# EAGLE design MJ808 clone - rev.5 - TCAN334 - poc (EAGLE 9.6.2)
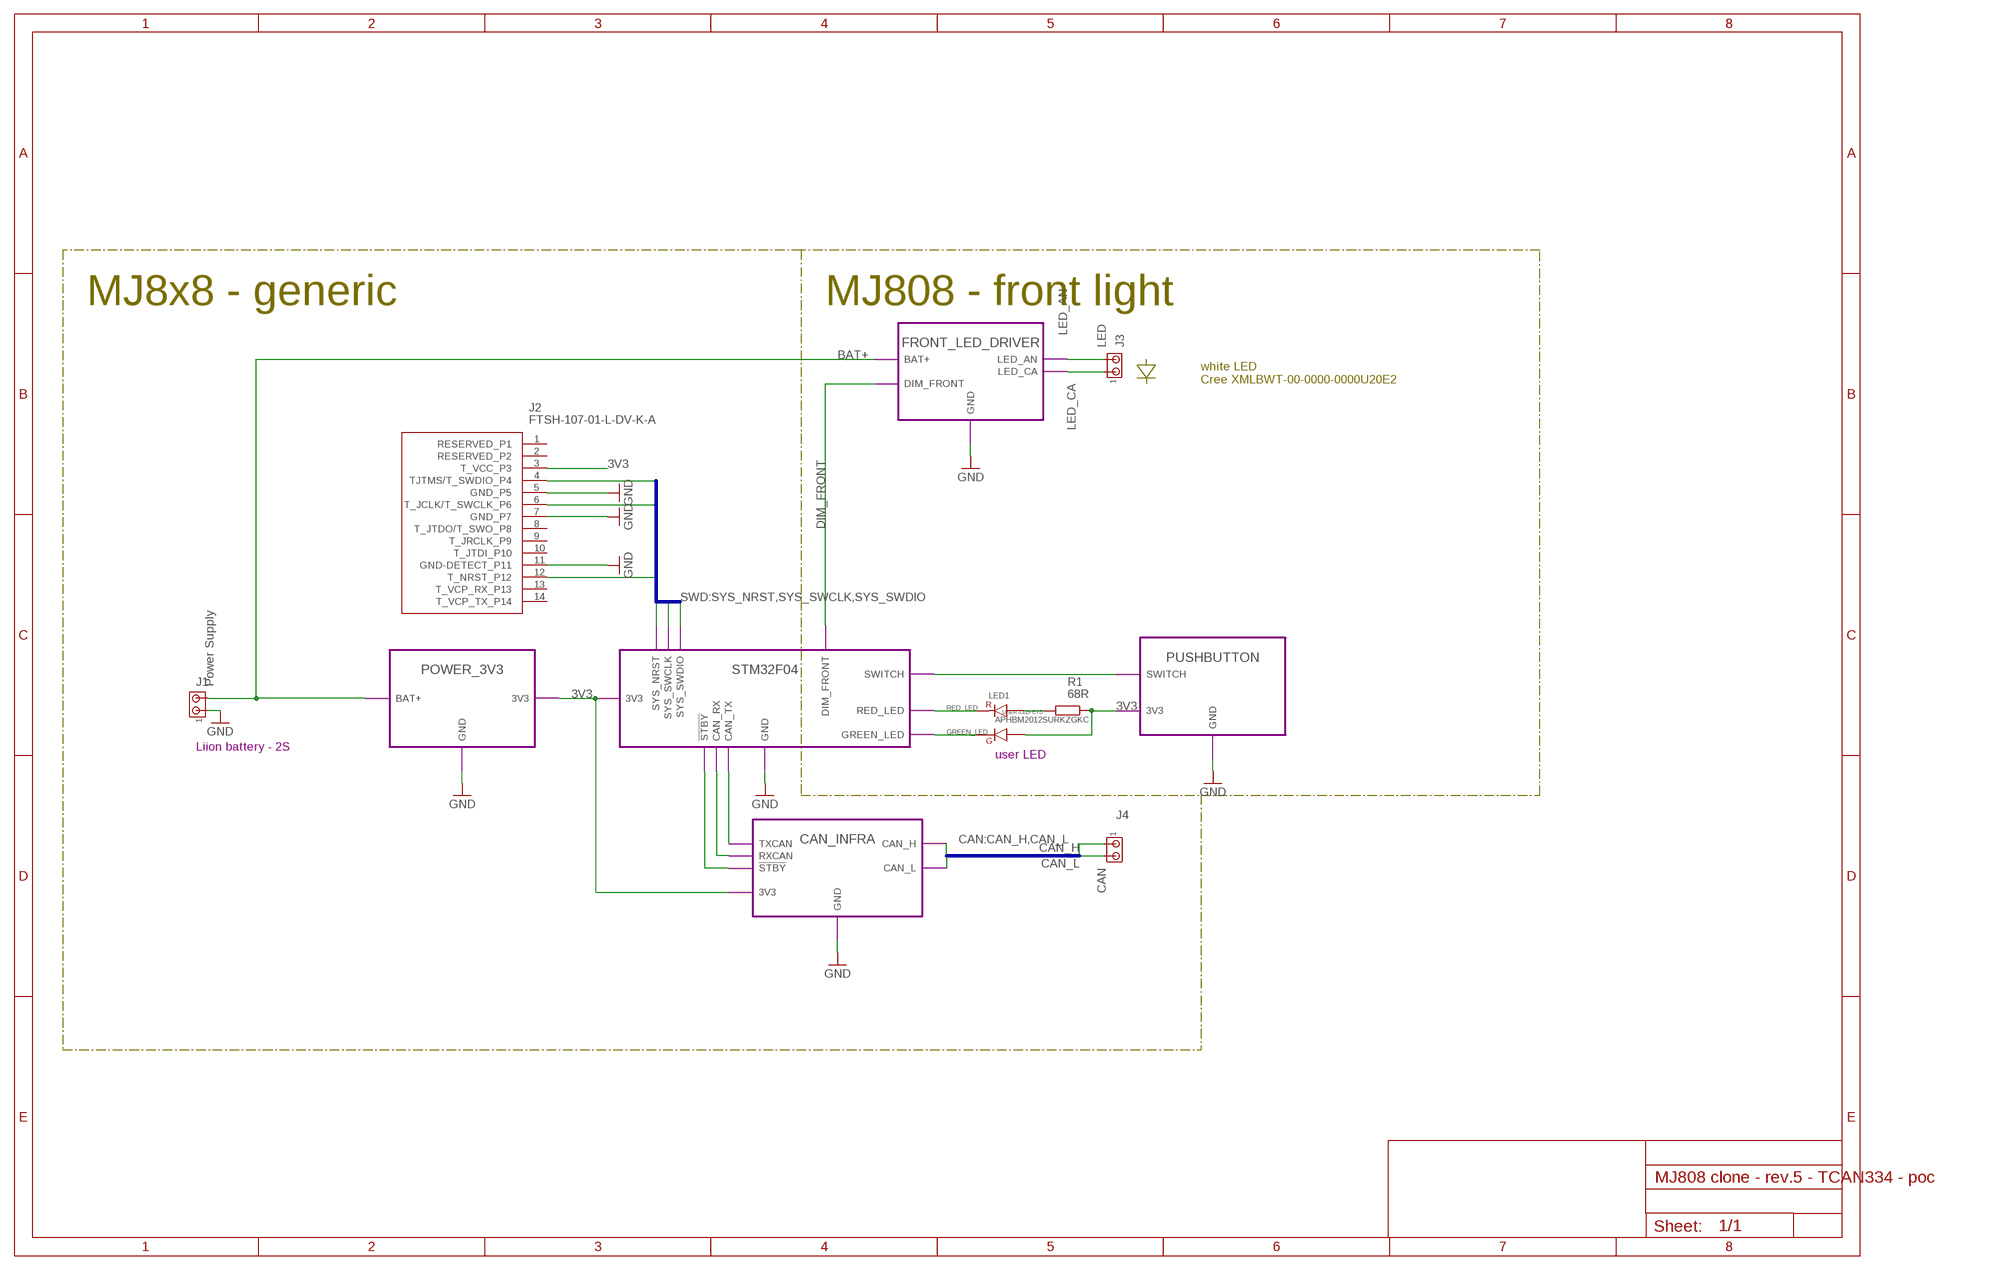
[diagram p0: schematic, sheet 1]

## Parts
J1  Power Supply  MTA02-100  [10X02MTA]
J2  FTSH-107-01-L-DV-K-A  [FTSH10701LDVKA]
J3  LED  MTA02-100  [10X02MTA]
J4  CAN  MTA02-100  [10X02MTA]
LED1  APHBM2012SURKZGKC  APHBM2012LSURKZGKC  [SMD]
R1  68R  R-EU_R0402  [R0402]

## Module instances
POWER_3V3 = POWER_3V3 (part numbers offset by 200)
STM32F04 = STM32 (part numbers offset by 300)
CAN_INFRA = CAN_INFRA (part numbers offset by 400)
FRONT_LED_DRIVER = LED_DRIVER_FRONT (part numbers offset by 500)
PUSHBUTTON = PUSHBUTTON (part numbers offset by 600)

## Nets
3V3 [3V3]: J2.3(T_VCC_P3) LED1.4 R1.1 ; port POWER_3V3.3V3 STM32F04.3V3 CAN_INFRA.3V3 PUSHBUTTON.3V3
!STBY! [signal]: port CAN_INFRA.!STBY! STM32F04.!STBY!
BAT+ [BAT+]: J1.2 ; port POWER_3V3.BAT+ FRONT_LED_DRIVER.BAT+
CAN_H [signal]: J4.1 ; port CAN_INFRA.CAN_H
CAN_L [signal]: J4.2 ; port CAN_INFRA.CAN_L
CAN_RX [signal]: port CAN_INFRA.RXCAN STM32F04.CAN_RX
CAN_TX [signal]: port CAN_INFRA.TXCAN STM32F04.CAN_TX
DIM_FRONT [signal]: port STM32F04.DIM_FRONT FRONT_LED_DRIVER.DIM_FRONT
GND: J1.1 J2.5(GND_P5) J2.7(GND_P7) J2.11(GND-DETECT_P11) ; port STM32F04.GND POWER_3V3.GND CAN_INFRA.GND FRONT_LED_DRIVER.GND PUSHBUTTON.GND
GREEN_LED [signal]: LED1.3 ; port STM32F04.GREEN_LED
LED_AN [BAT+]: J3.2 ; port FRONT_LED_DRIVER.LED_AN
LED_CA [BAT+]: J3.1 ; port FRONT_LED_DRIVER.LED_CA
RED_LED [signal]: LED1.2 ; port STM32F04.RED_LED
SWITCH: port STM32F04.SWITCH PUSHBUTTON.SWITCH
SYS_NRST [signal]: J2.12(T_NRST_P12) ; port STM32F04.SYS_NRST
SYS_SWCLK [signal]: J2.6(T_JCLK/T_SWCLK_P6) ; port STM32F04.SYS_SWCLK
SYS_SWDIO [signal]: J2.4(TJTMS/T_SWDIO_P4) ; port STM32F04.SYS_SWDIO
USER-LED-CTD [signal]: LED1.1 R1.2
Unconnected: J2.1(RESERVED_P1) J2.2(RESERVED_P2) J2.8(T_JTDO/T_SWO_P8) J2.9(T_JRCLK_P9) J2.10(T_JTDI_P10) J2.13(T_VCP_RX_P13) J2.14(T_VCP_TX_P14)

## Buses
CAN:CAN_H,CAN_L
SWD:SYS_NRST,SYS_SWCLK,SYS_SWDIO

## Notes on the sheet
- MJ8x8 - generic | MJ808 - front light
- white LED
  Cree XMLBWT-00-0000-0000U20E2
- Liion battery - 2S
- user LED

## Library data of the parts
J1 J3 J4 = con-amp:MTA02-100: AMP connector
J2 = STM32 JTAG 1.27mm 14pin header:FTSH-107-01-L-DV-K-A: Headers & Wire Housings .050" Micro Terminal Strip Source: Datasheet <https://componentsearchengine.com/Datasheets/1/FTSH-107-01-L-DV-K-A.pdf>; DESCRIPTION: Headers & Wire Housings .050" Micro Terminal Strip; HEIGHT: 5.97mm; MANUFACTURER_NAME: SAMTEC; MANUFACTURER_PART_NUMBER: FTSH-107-01-L-DV-K-A; MOUSER_PART_NUMBER: 200-FTSH10701LDVKA; MOUSER_PRICE-STOCK: https://www.mouser.com/Search/Refine.aspx?Keyword=200-FTSH10701LDVKA
LED1 = APHBM2012LSURKZGKC:APHBM2012LSURKZGKC
R1 = rcl:R-EU_: RESISTOR, European symbol; SPICEPREFIX: R

## Module POWER_3V3
Ports: GND(pwr) BAT+(pwr) 3V3(pwr)
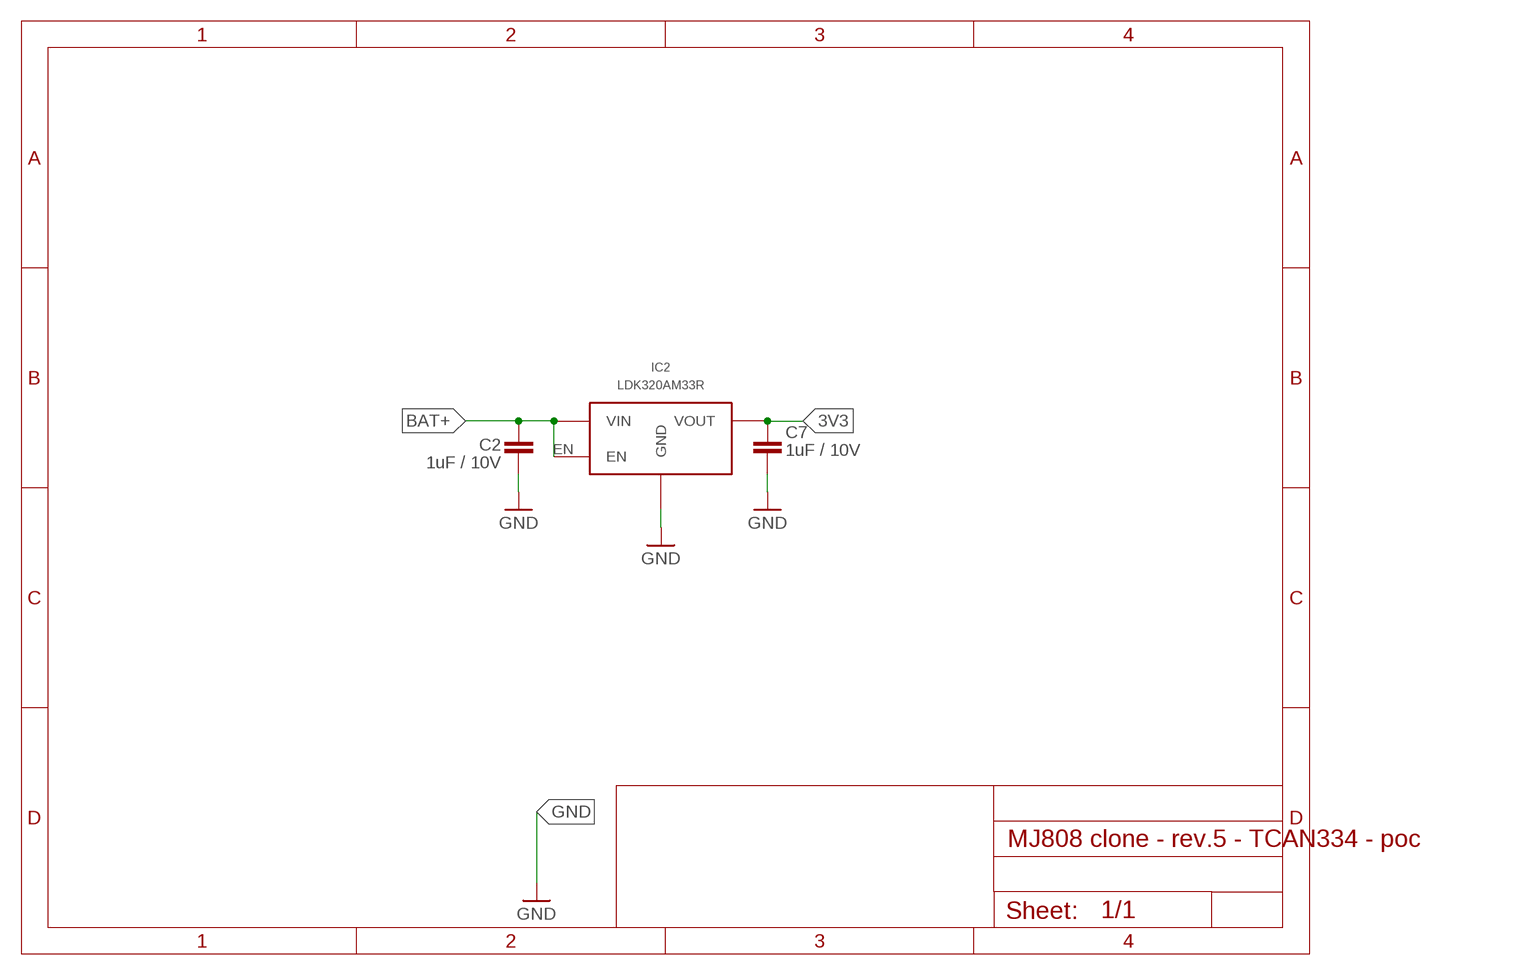
[diagram p1: schematic, module POWER_3V3, sheet 1]

### Parts
C2  1uF / 10V  C-EUC0402  [C0402]
C7  1uF / 10V  C-EUC0402  [C0402]
IC2  LDK320AM33R  LDK320SOT-23-5L  [SOT-23-5L]

### Nets
3V3 [3V3]: C7.2 IC2.OUT(VOUT)
BAT+ [BAT+]: C2.1 IC2.EN IC2.IN(VIN)
GND: C2.2 C7.1 IC2.GND

### Library data of the parts
C2 C7 = rcl:C-EU: CAPACITOR, European symbol; SPICEPREFIX: C
IC2 = LDK320 5V LDO:LDK320

## Module STM32
Ports: GND(pwr) 3V3(pwr) SYS_NRST(in) SYS_SWCLK(io) SYS_SWDIO(io) CAN_RX(in) CAN_TX(out) !STBY!(out) SWITCH(in) GREEN_LED(hiz) RED_LED(hiz) DIM_FRONT(out)
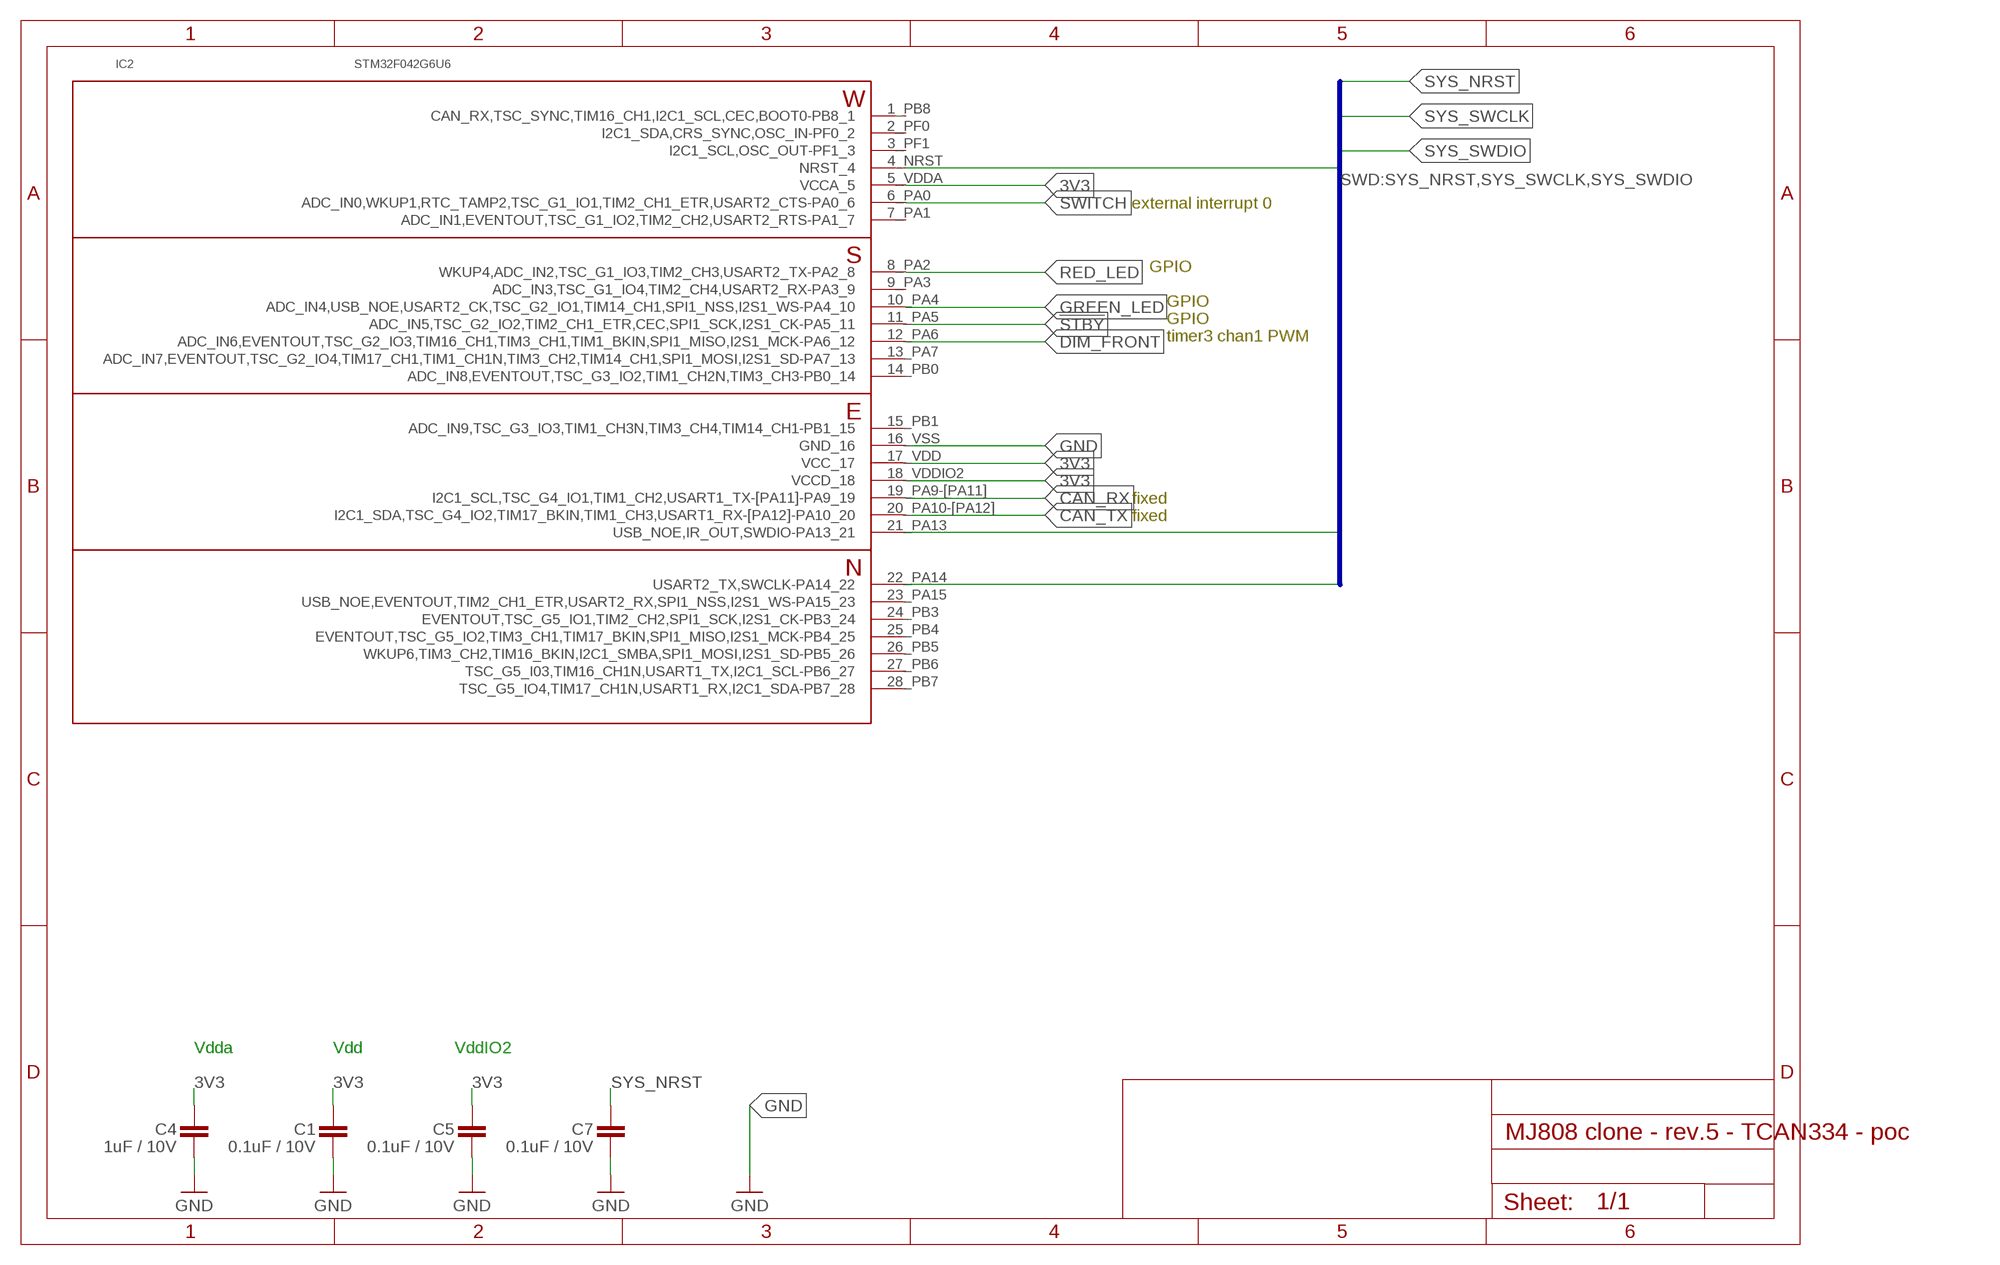
[diagram p2: schematic, module STM32, sheet 1]

### Parts
C1  0.1uF / 10V  C-EUC0402  [C0402]
C4  1uF / 10V  C-EUC0402  [C0402]
C5  0.1uF / 10V  C-EUC0402  [C0402]
C7  0.1uF / 10V  C-EUC0402  [C0402]
IC2  STM32F042G6U6  STM32F042G6  [UFQFPN-28]

### Nets
3V3 [3V3]: C1.2 C4.2 C5.2 IC2.5_VDDA(VCCA_5) IC2.17_VDD(VCC_17) IC2.18_VDDIO2(VCCD_18)
!STBY!: IC2.11_PA5(ADC_IN5,TSC_G2_IO2,TIM2_CH1_ETR,CEC,SPI1_SCK,I2S1_CK-PA5_11)
CAN_RX: IC2.19_PA9-[PA11](I2C1_SCL,TSC_G4_IO1,TIM1_CH2,USART1_TX-[PA11]-PA9_19)
CAN_TX: IC2.20_PA10-[PA12](I2C1_SDA,TSC_G4_IO2,TIM17_BKIN,TIM1_CH3,USART1_RX-[PA12]-PA10_20)
DIM_FRONT: IC2.12_PA6(ADC_IN6,EVENTOUT,TSC_G2_IO3,TIM16_CH1,TIM3_CH1,TIM1_BKIN,SPI1_MISO,I2S1_MCK-PA6_12)
GND: C1.1 C4.1 C5.1 C7.1 IC2.16_VSS(GND_16)
GREEN_LED: IC2.10_PA4(ADC_IN4,USB_NOE,USART2_CK,TSC_G2_IO1,TIM14_CH1,SPI1_NSS,I2S1_WS-PA4_10)
RED_LED: IC2.8_PA2(WKUP4,ADC_IN2,TSC_G1_IO3,TIM2_CH3,USART2_TX-PA2_8)
SWITCH: IC2.6_PA0(ADC_IN0,WKUP1,RTC_TAMP2,TSC_G1_IO1,TIM2_CH1_ETR,USART2_CTS-PA0_6)
SYS_NRST: C7.2 IC2.4_NRST(NRST_4)
SYS_SWCLK: IC2.22_PA14(USART2_TX,SWCLK-PA14_22)
SYS_SWDIO: IC2.21_PA13(USB_NOE,IR_OUT,SWDIO-PA13_21)
Unconnected: IC2.1_PB8(CAN_RX,TSC_SYNC,TIM16_CH1,I2C1_SCL,CEC,BOOT0-PB8_1) IC2.2_PF0(I2C1_SDA,CRS_SYNC,OSC_IN-PF0_2) IC2.3_PF1(I2C1_SCL,OSC_OUT-PF1_3) IC2.7_PA1(ADC_IN1,EVENTOUT,TSC_G1_IO2,TIM2_CH2,USART2_RTS-PA1_7) IC2.9_PA3(ADC_IN3,TSC_G1_IO4,TIM2_CH4,USART2_RX-PA3_9) IC2.13_PA7(ADC_IN7,EVENTOUT,TSC_G2_IO4,TIM17_CH1,TIM1_CH1N,TIM3_CH2,TIM14_CH1,SPI1_MOSI,I2S1_SD-PA7_13) IC2.14_PB0(ADC_IN8,EVENTOUT,TSC_G3_IO2,TIM1_CH2N,TIM3_CH3-PB0_14) IC2.15_PB1(ADC_IN9,TSC_G3_IO3,TIM1_CH3N,TIM3_CH4,TIM14_CH1-PB1_15) IC2.23_PA15(USB_NOE,EVENTOUT,TIM2_CH1_ETR,USART2_RX,SPI1_NSS,I2S1_WS-PA15_23) IC2.24_PB3(EVENTOUT,TSC_G5_IO1,TIM2_CH2,SPI1_SCK,I2S1_CK-PB3_24) IC2.25_PB4(EVENTOUT,TSC_G5_IO2,TIM3_CH1,TIM17_BKIN,SPI1_MISO,I2S1_MCK-PB4_25) IC2.26_PB5(WKUP6,TIM3_CH2,TIM16_BKIN,I2C1_SMBA,SPI1_MOSI,I2S1_SD-PB5_26) IC2.27_PB6(TSC_G5_I03,TIM16_CH1N,USART1_TX,I2C1_SCL-PB6_27) IC2.28_PB7(TSC_G5_IO4,TIM17_CH1N,USART1_RX,I2C1_SDA-PB7_28)

### Buses
SWD:SYS_NRST,SYS_SWCLK,SYS_SWDIO

### Notes on the sheet
- external interrupt 0
- GPIO
- GPIO
- GPIO
- timer3 chan1 PWM
- fixed
- fixed
- Vdda | Vdd | VddIO2

### Library data of the parts
C1 C4 C5 C7 = rcl:C-EU: CAPACITOR, European symbol; SPICEPREFIX: C
IC2 = STM32F042G6:STM32F042G6

## Module CAN_INFRA
Ports: GND(pwr) 3V3(pwr) CAN_H(io) CAN_L(io) TXCAN(in) RXCAN(out) !STBY!(in)
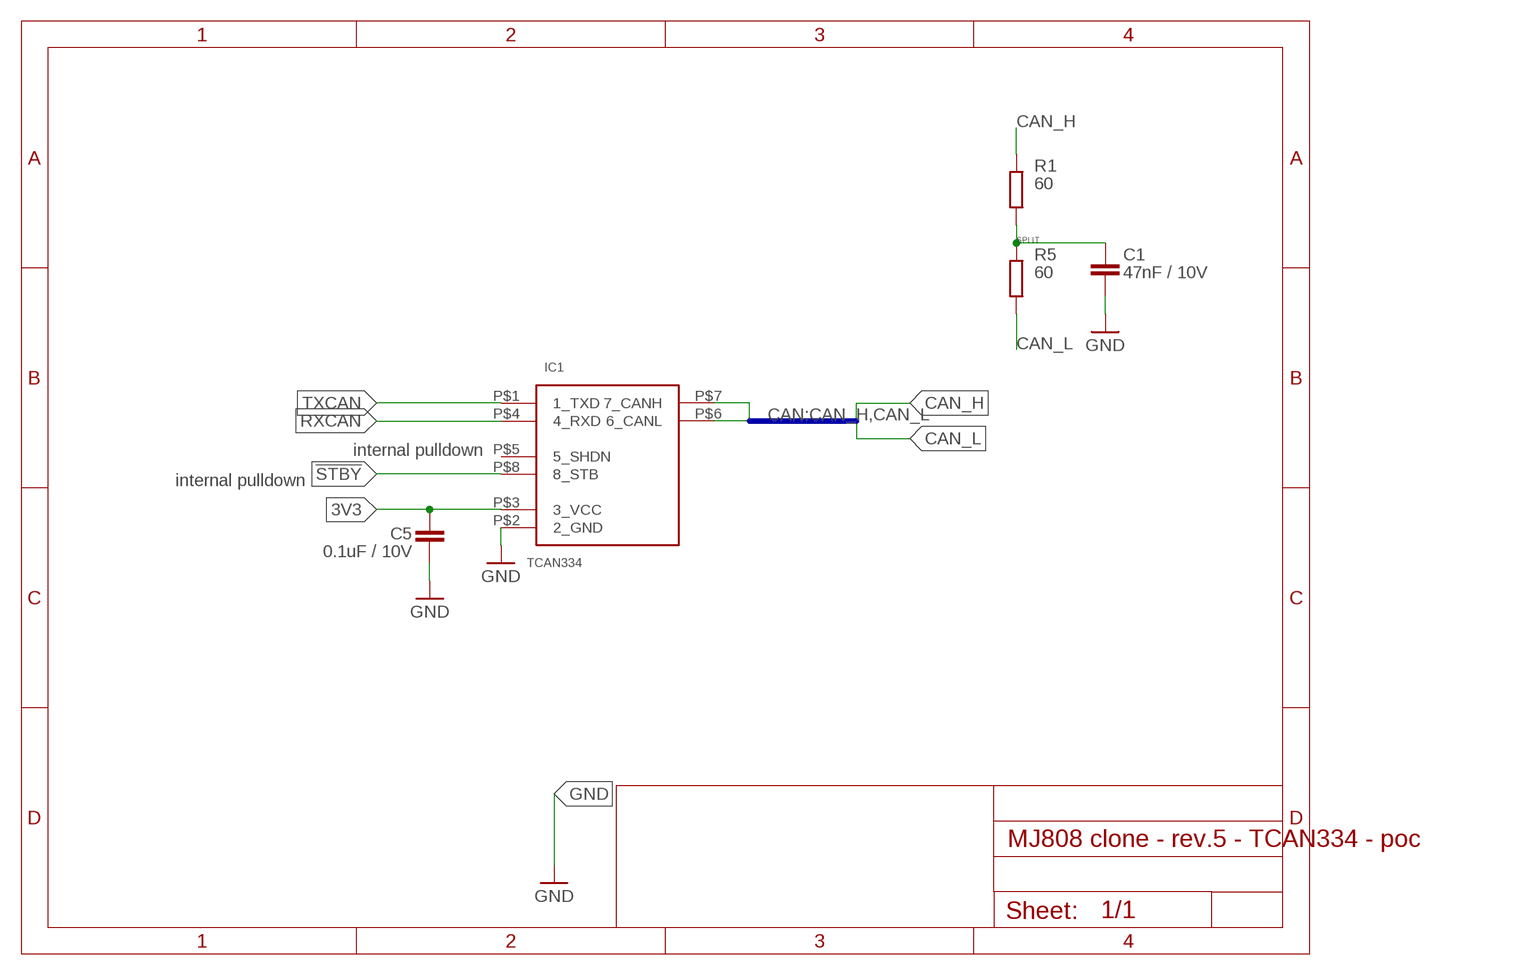
[diagram p3: schematic, module CAN_INFRA, sheet 1]

### Parts
C1  47nF / 10V  C-EUC0402  [C0402]
C5  0.1uF / 10V  C-EUC0402  [C0402]
IC1  TCAN334  CAN33X  [SOT23-8]
R1  60  R-EU_R0805  [R0805]
R5  60  R-EU_R0805  [R0805]

### Nets
3V3 [3V3]: C5.1 IC1.P$3(3_VCC)
!STBY! [signal]: IC1.P$8(8_STB)
CAN_H: IC1.P$7(7_CANH) R1.2
CAN_L: IC1.P$6(6_CANL) R5.1
GND: C1.2 C5.2 IC1.P$2(2_GND)
RXCAN [signal]: IC1.P$4(4_RXD)
SPLIT [signal]: C1.1 R1.1 R5.2
TXCAN [signal]: IC1.P$1(1_TXD)
Unconnected: IC1.P$5(5_SHDN)

### Buses
CAN:CAN_H,CAN_L

### Notes on the sheet
- internal pulldown
- internal pulldown

### Library data of the parts
C1 C5 = rcl:C-EU: CAPACITOR, European symbol; SPICEPREFIX: C
IC1 = TCAN33x - 3.3V CAN Transciever:CAN33X
R1 R5 = rcl:R-EU_: RESISTOR, European symbol; SPICEPREFIX: R

## Module LED_DRIVER_FRONT
Ports: GND(pwr) LED_AN(pwr) LED_CA(pwr) DIM_FRONT(in) BAT+(pwr)
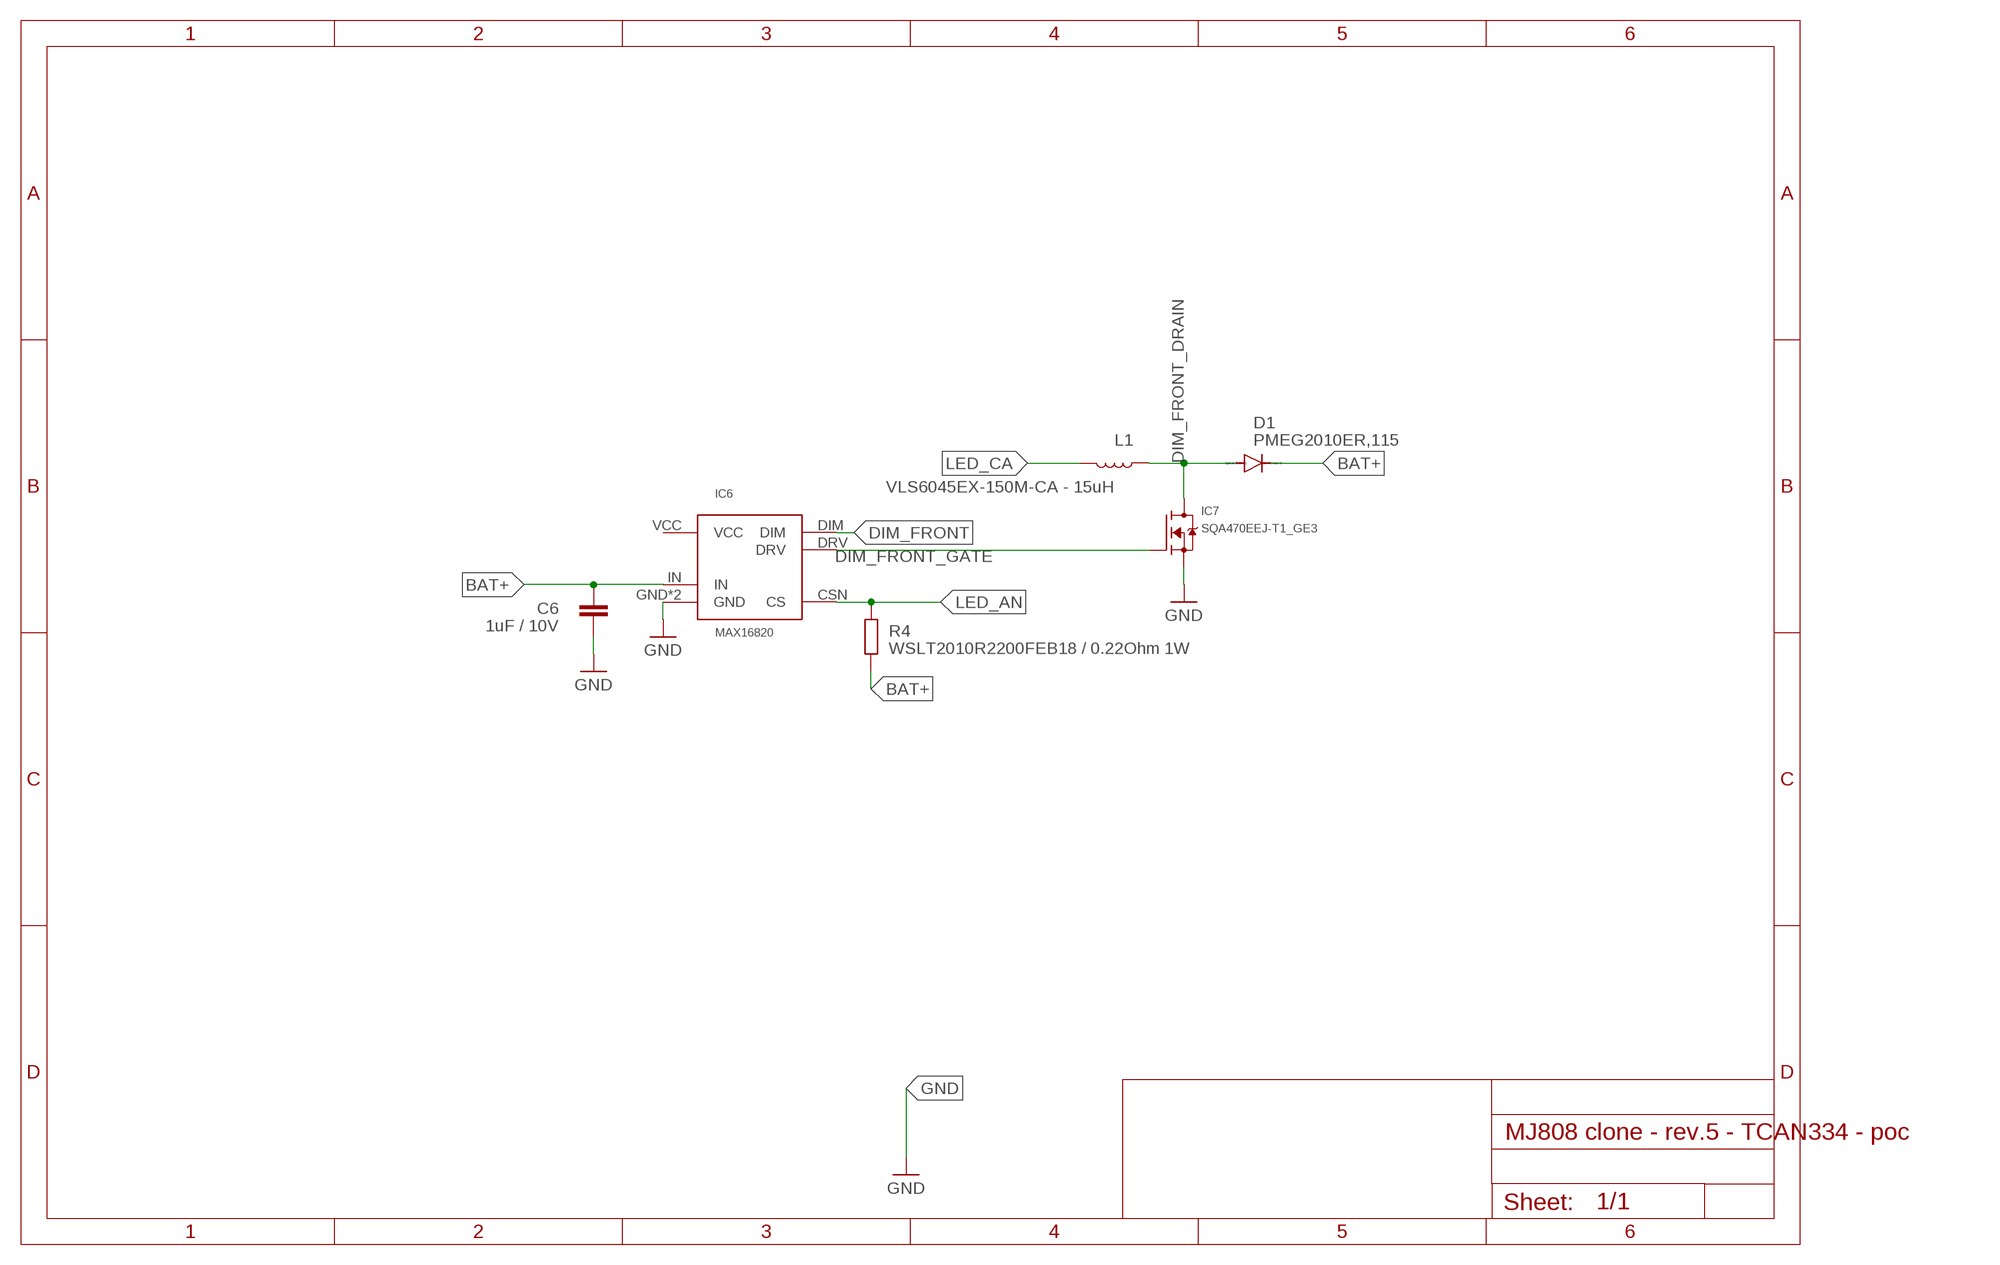
[diagram p4: schematic, module LED_DRIVER_FRONT, sheet 1]

### Parts
C6  1uF / 10V  C-EUC0402  [C0402]
D1  PMEG2010ER,115  DIODE-SOD123  [SOD123]
IC6  MAX16820  [TDFN-6-EP]
IC7  SQA470EEJ-T1_GE3  SIA456DJ  [SC-70-6]
L1  VLS6045EX-150M-CA - 15uH  INDUCTOR-SRN6045-33UH  [SRN6045]
R4  WSLT2010R2200FEB18 / 0.22Ohm 1W  R-EU_R2010  [R2010]

### Nets
BAT+ [BAT+]: C6.1 D1.C IC6.IN R4.2
DIM_FRONT [signal]: IC6.DIM
DIM_FRONT_DRAIN [signal]: D1.A IC7.1D(D) IC7.2D(D) IC7.5D(D) IC7.6D(D) IC7.D L1.1
DIM_FRONT_GATE [signal]: IC6.DRV IC7.3G(G)
GND: C6.2 IC6.GND IC6.GND1(GND) IC7.4S(S) IC7.S
LED_AN [BAT+]: IC6.CSN(CS) R4.1
LED_CA [BAT+]: L1.2

### Power pins joined to a net without a drawn wire
VCC: IC6.VCC

### Library data of the parts
C6 = rcl:C-EU: CAPACITOR, European symbol; SPICEPREFIX: C
D1 = diode:DIODE-: DIODE
IC6 = MAX16820 LED Driver, constant current:MAX16820
IC7 = SIA456DJ-T1-GE3  N-Fet:SIA456DJ
L1 = SparkFun-Coils:INDUCTOR: Inductors Resist changes in electrical current. Basically a coil of wire. SparkFun Products: SparkFun Load Cell Amplifier - HX711 <https://www.sparkfun.com/products/13879> IOIO-OTG - V2.2 <https://www.sparkfun.com/products/13613>; PROD_ID: NDUC-11627; VALUE: 33µH/±20%/1.4A
R4 = rcl:R-EU_: RESISTOR, European symbol; SPICEPREFIX: R

## Module PUSHBUTTON
Ports: SWITCH(out) GND(pwr) 3V3(pwr)
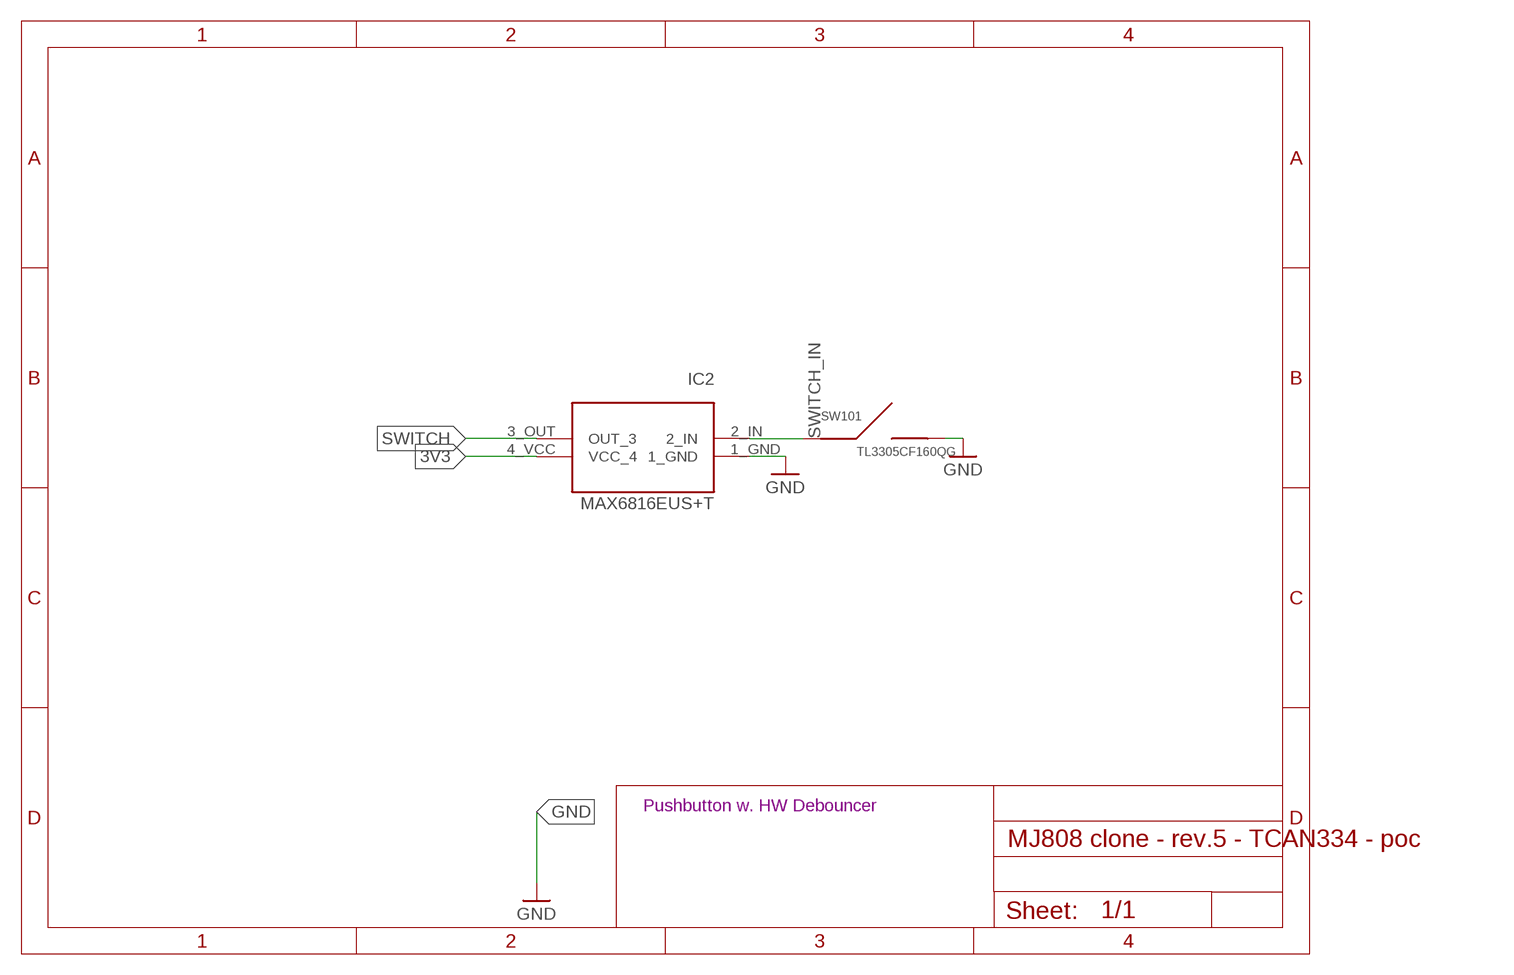
[diagram p5: schematic, module PUSHBUTTON, sheet 1]

### Parts
IC2  MAX6816EUS+T  MAX6816  [4SOT143]
SW101  TL3305CF160QG  TL3305-844809  [SMD]

### Nets
3V3: IC2.4_VCC(VCC_4)
GND: IC2.1_GND SW101.3 SW101.4
SWITCH: IC2.3_OUT(OUT_3)
SWITCH_IN [3V3]: IC2.2_IN SW101.1 SW101.2

### Notes on the sheet
- Pushbutton w. HW Debouncer

### Library data of the parts
IC2 = MAX6818 CMOS Switch debouncer:MAX6816
SW101 = TL3305-844809 SPST-NO Tact Switch:TL3305-844809

## Net classes
0 GND: width 0.25 mm, drill 0.35 mm, clearance 0.19 mm
1 BAT+: width 0.5 mm, drill 0.35 mm, clearance 0.19 mm
3 signal: width 0.25 mm, drill 0.35 mm, clearance 0.19 mm
4 3V3: width 0.25 mm, drill 0.35 mm, clearance 0.19 mm

## Board
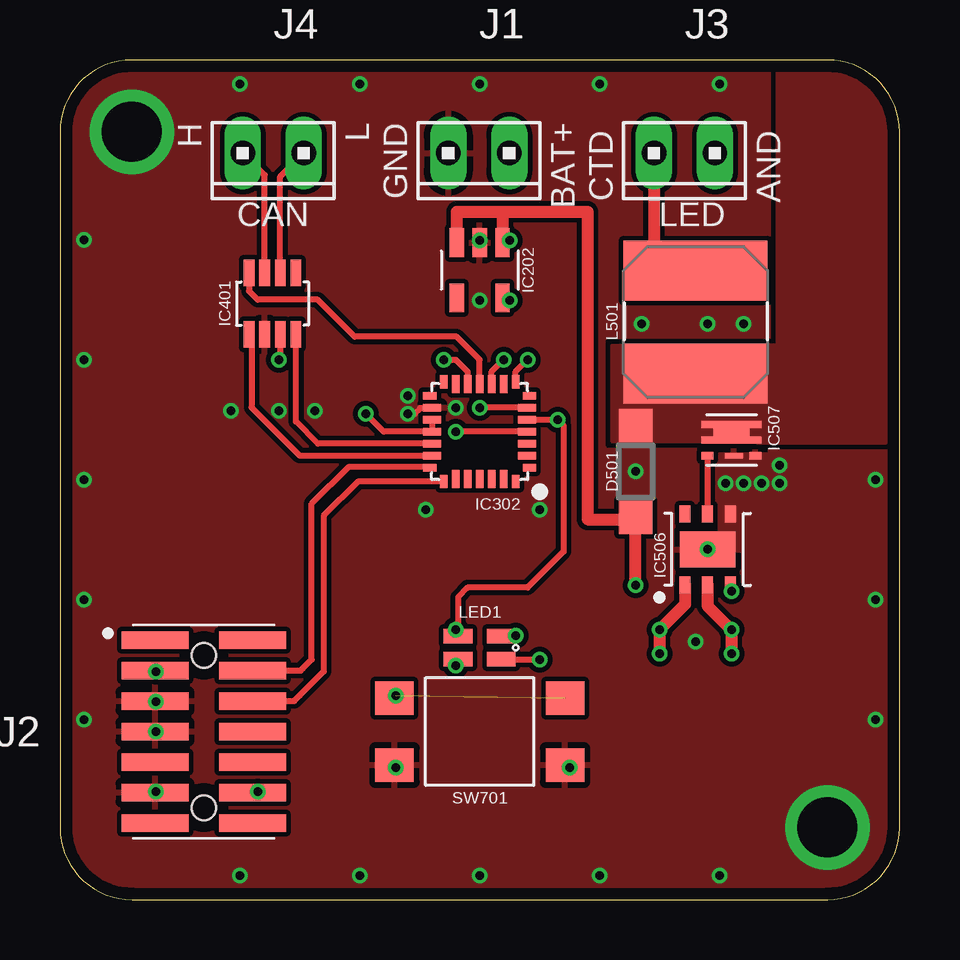
[diagram p6: board, top side]
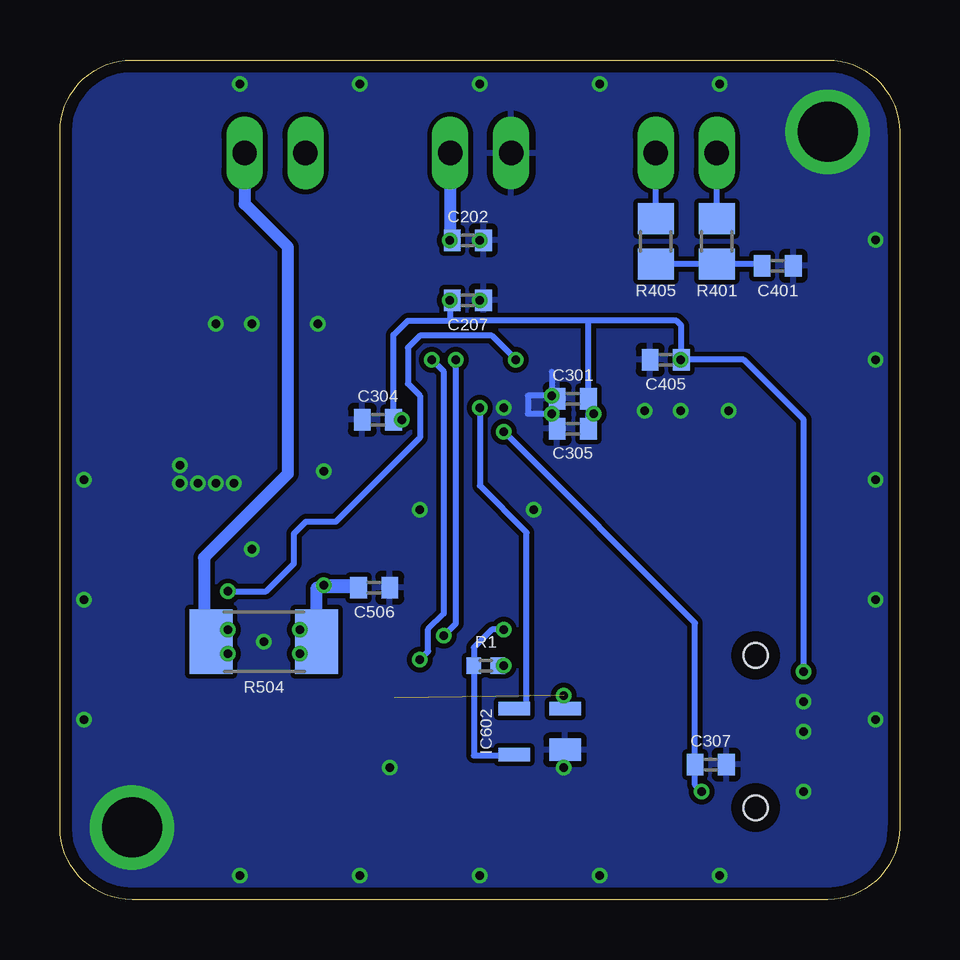
[diagram p7: board, bottom side, seen from below]

Size 35 x 35 mm. Coordinates in mm from the lower left corner, seen from the top.
Outline: 0,32 0,3 arc90 3,0 32,0 arc90 35,3 35,32 arc90 32,35 3,35 arc90 0,32
Copper layers (1*16): Top 0.035mm / dielectric 1.5mm / Bottom 0.035mm
Design rules "markovac_2layer": minimum track width 0.2mm, minimum drill 0.35mm, track to track 0.2mm, track to pad 0.2mm, pad to pad 0.2mm, via to via 0.2mm, smd to smd 0.2mm, copper to edge 0.5mm, drill to drill 8mil, minimum pad ring 0.15mm, minimum via ring 0.15mm, stop-mask expansion 4mil, vias tented up to drill 0.35mm, thermal gap 10mil
tRestrict: 2 lines

### Footprints (pad centres in the part's own frame; a part is rotated, then mirrored left to right if it is on the bottom)
C0402 = smd 0.7 x 0.9: 1 -0.65,0; 2 0.65,0
SOD123 = smd 1.4 x 1.4: A 1.9,0; C -1.9,0
SOT-23-5L = smd 0.6 x 1.2: ADJ/NC -0.95,-1.15; EN -0.95,1.15; GND 0,1.15; IN 0.95,1.15; OUT 0.95,-1.15
UFQFPN-28 = smd 0.55 x 0.3: 1_PB8 -2.08,1.5; 7_PA1 -2.08,-1.5; 15_PB1 2.08,-1.5; 21_PA13 2.08,1.5 | smd 0.75 x 0.3: 2_PF0 -1.98,1; 3_PF1 -1.98,0.5; 4_NRST -1.98,0; 5_VDDA -1.98,-0.5; 6_PA0 -1.98,-1; 16_VSS 1.98,-1; 17_VDD 1.98,-0.5; 18_VDDIO2 1.98,0; 19_PA9-[PA11] 1.98,0.5; 20_PA10-[PA12] 1.98,1 | smd 0.3 x 0.55: 8_PA2 -1.5,-2.08; 14_PB0 1.5,-2.08; 22_PA14 1.5,2.08; 28_PB7 -1.5,2.08 | smd 0.3 x 0.75: 9_PA3 -1,-1.98; 10_PA4 -0.5,-1.98; 11_PA5 0,-1.98; 12_PA6 0.5,-1.98; 13_PA7 1,-1.98; 23_PA15 1,1.98; 24_PB3 0.5,1.98; 25_PB4 0,1.98; 26_PB5 -0.5,1.98; 27_PB6 -1,1.98
SOT23-8 = smd 0.45 x 1.1: P$1 -0.975,-1.275; P$2 -0.325,-1.275; P$3 0.325,-1.275; P$4 0.975,-1.275; P$5 0.975,1.275; P$6 0.325,1.275; P$7 -0.325,1.275; P$8 -0.975,1.275
TDFN-6-EP = smd 0.71 x 0.46: CSN -1.48,0; DIM -1.48,-0.94; DRV 1.48,0; GND1 1.48,-0.95; IN -1.48,0.94; VCC 1.48,0.95 | smd 1.5 x 2.3: GND 0,0
SC-70-6 = smd 0.5 x 0.3: 1D -1,0.65; 2D -1,0; 3G -1,-0.65; 4S 1,-0.65; 5D 1,0; 6D 1,0.65 | smd 1.5 x 0.95: D 0,0.325 | smd 0.75 x 0.23: S 0.1,-0.65
4SOT143 = smd 0.94 x 1.31: 1_GND -0.76,-1.06 | smd 0.55 x 1.31: 2_IN 0.96,-1.06; 3_OUT 0.96,1.06; 4_VCC -0.96,1.06
10X02MTA = drill 1.016 long: 1 1.27,0; 2 -1.27,0
FTSH10701LDVKA = smd 0.74 x 2.79: 1 -3.81,-2.035; 2 -3.81,2.035; 3 -2.54,-2.035; 4 -2.54,2.035; 5 -1.27,-2.035; 6 -1.27,2.035; 7 0,-2.035; 8 0,2.035; 9 1.27,-2.035; 10 1.27,2.035; 11 2.54,-2.035; 12 2.54,2.035; 13 3.81,-2.035; 14 3.81,2.035 | hole 1.02: -3.175,0; 3.175,0
SRN6045 = smd 2.5 x 6: 1 -2.175,0; 2 2.125,0
SMD = smd 1.2 x 0.6: 1 0.9,0.48; 2 -0.9,0.48; 3 -0.9,-0.48; 4 0.9,-0.48
R0402 = smd 0.6 x 0.7: 1 -0.5,0; 2 0.5,0
R0805 = smd 1.3 x 1.5: 1 -0.95,0; 2 0.95,0
R2010 = smd 1.8 x 2.7: 1 -2.2,0; 2 2.2,0
SMD' = smd 1.6 x 1.4: 1 -3.556,-1.397; 2 3.556,-1.397; 3 -3.556,1.397; 4 3.556,1.397

### Placement (x,y rotation side)
C202  1uF / 10V  [C0402]  18,27.48 0 bottom
C207  1uF / 10V  [C0402]  18,24.98 180 bottom
C301  0.1uF / 10V  [C0402]  13.62,20.88 0 bottom
C304  1uF / 10V  [C0402]  21.75,20 0 bottom
C305  0.1uF / 10V  [C0402]  13.62,19.63 0 bottom
C307  0.1uF / 10V  [C0402]  7.87,5.63 180 bottom
C401  47nF / 10V  [C0402]  5.08,26.42 0 bottom
C405  0.1uF / 10V  [C0402]  9.75,22.5 180 bottom
C506  1uF / 10V  [C0402]  21.9,13 0 bottom
D501  PMEG2010ER,115  [SOD123]  24,17.85 90 top
IC202  LDK320AM33R  [SOT-23-5L]  17.5,26.23 0 top
IC302  STM32F042G6U6  [UFQFPN-28]  17.5,19.5 180 top
IC401  TCAN334  [SOT23-8]  8.86,24.84 0 top
IC506  MAX16820  [TDFN-6-EP]  27,14.6 90 top
IC507  SQA470EEJ-T1_GE3  [SC-70-6]  28,19.15 0 top
IC602  MAX6816EUS+T  [4SOT143]  15,7 90 bottom
J1  17.46,31.12 180 top
J2  6,7 270 top
J3  26.03,31.12 180 top
J4  8.89,31.12 180 top
L501  VLS6045EX-150M-CA - 15uH  [SRN6045]  26.5,24.1 90 top
LED1  17.5,10.5 180 top
R1  17.25,9.75 0 bottom
R401  60  [R0805]  7.62,27.43 90 bottom
R405  60  [R0805]  10.16,27.43 270 bottom
R504  WSLT2010R2200FEB18 / 0.22Ohm 1W  [R2010]  26.5,10.75 0 bottom
SW701  TL3305CF160QG  [SMD']  17.5,7 180 top

### Tracks (layer width: path | path; a pad name or v marks a point on that pad's centre or on a via)
3V3  (via drill 0.35)
  Top 0.25: v16.5,11.25 16.6,11.15 LED1.4 16.6,12.6 17,13 19.5,13 21,14.5 21,19.75 v20.75,20 IC302.5_VDDA | IC401.P$3 9.18,22.56 v9.12,22.5 | v12.75,20.25 13.5,19.5 IC302.18_VDDIO2 IC302.17_VDD | IC202.OUT 18.65,25.08 v18.75,24.98 | J2.3 v4,9.51 v4,9.5
  Bottom 0.25: C305.2 12.97,20.23 12.77,20.23 v12.75,20.25 12.97,20.25 C301.2 12.97,24.13 | v20.75,20 C304.2 21.1,23.53 20.5,24.13 18.75,24.13 | 12.97,24.13 18.75,24.13 | IC602.4_VCC 16.1,6 17.75,6 R1.1 17.75,10.5 17,11.25 v16.5,11.25 | 12.97,24.13 9.3,24.13 9.1,23.93 C405.1 | 18.75,24.13 18.75,24.88 C207.2 v18.75,24.98 | C405.1 6.5,22.5 4,20 v4,9.5 | C405.1 v9.12,22.5
!STBY!
  Top 0.25: IC401.P$8 7.88,25.37 8.25,25 10.75,25 12.29,23.46 16.54,23.46 17.5,22.5 IC302.11_PA5
BAT+  (via drill 0.35)
  Top 0.5: IC202.EN 16.55,28.67 18.45,28.67 | 18.45,28.67 IC202.IN 18.55,27.48 v18.75,27.48 | IC506.IN 26.06,12.31 v25,11.25 v25,10.25 | D501.C 24,15.85 | 18.45,28.67 22,28.67 22,15.85 24,15.85 | v24,13.1 24,15.85
  Bottom 0.5: v25,10.25 24.8,10.25 R504.2 24.3,13 C506.1 22.65,13.1 v24,13.1 | v18.75,27.48 C202.1 18.73,27.56 J1.2
CAN_H
  Top 0.25: IC401.P$7 8.53,30.2 J4.1
  Bottom 0.25: R401.2 J4.1
CAN_INFRA:SPLIT
  Bottom 0.25: C401.1 5.79,26.48 R401.1 R405.2
CAN_L
  Top 0.25: IC401.P$6 9.18,30.14 J4.2
  Bottom 0.25: R405.1 J4.2
CAN_RX
  Top 0.25: IC302.19_PA9-[PA11] 10.75,19 9.83,19.92 IC401.P$4
CAN_TX
  Top 0.25: IC401.P$1 7.98,23.47 7.98,20.52 10,18.5 IC302.20_PA10-[PA12]
DIM_FRONT  (via drill 0.35)
  Top 0.25: IC506.DIM 27.94,12.91 v28,12.85 | v16,22.5 16.5,22.5 17,22 IC302.12_PA6
  Bottom 0.25: v16,22.5 17,23.5 20,23.5 20.5,23 20.5,21.5 20,21 20,19.25 23.5,15.75 24.75,15.75 25.25,15.25 25.25,14 26.4,12.85 v28,12.85
FRONT_LED_DRIVER:DIM_FRONT_DRAIN
  pour Top (rank 3, no thermals): 29.2,23.1 23,23.1 23,19.1 29.2,19.1
  pour Top (rank 3, no thermals): 29.95,23.1 29.95,35.55 34.4,35.55 34.4,19.05 29.1,19.05 29.1,23.1
FRONT_LED_DRIVER:DIM_FRONT_GATE
  Top 0.25: IC507.3G IC506.DRV
GND  (via drill 0.35, 2.5)
  Top 0.25: 15.49,20.48 15.01,20.48 14.78,20.25 v14.5,20.25
  Bottom 0.25: C305.1 14.5,19.63 v14.5,20.25 15.5,20.25 15.5,21 14.27,21 C301.1 14.5,21.1 14.5,22
  other vias: 3,32 32,3 17.5,24.98 14,5.5 27.75,17.35 28.5,17.35 29.25,17.35 30,17.35 30,18.1 9.12,20.38 34,17.5 1,17.5 1,12.5 1,7.5 1,22.5 1,27.5 17.5,1 22.5,1 27.5,1 12.5,1 7.5,1 34,12.5 34,7.5 17.5,34 22.5,34 27.5,34 12.5,34 7.5,34 27,14.6 14.5,21 17.5,27.48 26.5,10.75 16.5,20.5 24,17.85 20,16.25 15.25,16.25 10.62,20.38 7.12,20.38 21.25,5.5 27,24 28.5,24 24.25,24 4,7 4,4.5 4,8.25
  pour Top (rank 6): 0,35 35,35 35,0 0,0
  pour Bottom (rank 6): 0,35 35,35 35,0 0,0
  pour Top (no thermals): 27.5,18.6 30.5,18.6 30.5,14.6 27.5,14.6
GREEN_LED  (via drill 0.35)
  Top 0.25: LED1.3 18.42,11 v19,11 | IC302.10_PA4 18,22 v18.5,22.5
  Bottom 0.25: v19,11 18.5,11.5 v18.5,22.5
LED_AN  (via drill 0.35)
  Top 0.5: IC506.CSN 27,12.25 v28,11.25 v28,10.25
  Bottom 0.5: v28,11.25 28.2,11.25 R504.1 29,11.05 29,14.25 25.5,17.75 25.5,27.2 27.3,29 J3.2
LED_CA
  Top 0.5: J3.1 24.76,27 25.55,26.22 L501.2
PUSHBUTTON:SWITCH_IN  (via drill 0.35)  (1 unrouted)
  Top 0.25: SW701.2 14,8.46 v14,8.5
  Bottom 0.25: IC602.2_IN 13.94,8.44 v14,8.5
RED_LED  (via drill 0.35)
  Top 0.25: LED1.2 18.48,10.02 18.5,10 v20,10 | IC302.8_PA2 19,22 v19.5,22.5
  Bottom 0.25: v20,10 19.65,10.35 19.65,11.27 19,11.92 19,22 v19.5,22.5
SWITCH  (via drill 0.35)
  Top 0.25: IC302.6_PA0 v17.5,20.5
  Bottom 0.25: v17.5,20.5 17.5,17.25 15.55,15.3 15.55,8.1 16.06,8.1 IC602.3_OUT
SYS_NRST  (via drill 0.35)
  Top 0.25: IC302.4_NRST v16.5,19.5 | J2.12 8.07,4.5 v8.25,4.5
  Bottom 0.25: v16.5,19.5 8.52,11.53 C307.2 8.52,4.78 v8.25,4.5
SYS_SWCLK
  Top 0.25: IC302.22_PA14 12.42,17.42 11,16 11,9.5 10,8.5 9.77,8.27 J2.6
SYS_SWDIO
  Top 0.25: IC302.21_PA13 15.39,18.03 12.02,18.03 10.5,16.5 10.5,10 10.12,9.63 10.04,9.54 J2.4
USER-LED-CTD  (via drill 0.35)
  Top 0.25: LED1.1 16.6,9.85 v16.5,9.75
  Bottom 0.25: v16.5,9.75 R1.2

### Text on the board
tPlace: H | L | GND | BAT+ | CTD | AND | CAN | LED
tStop: MJ808 POC / ejovrh rev.5a